# EAGLE design wemos_gpio_7x (EAGLE 7.7.0)
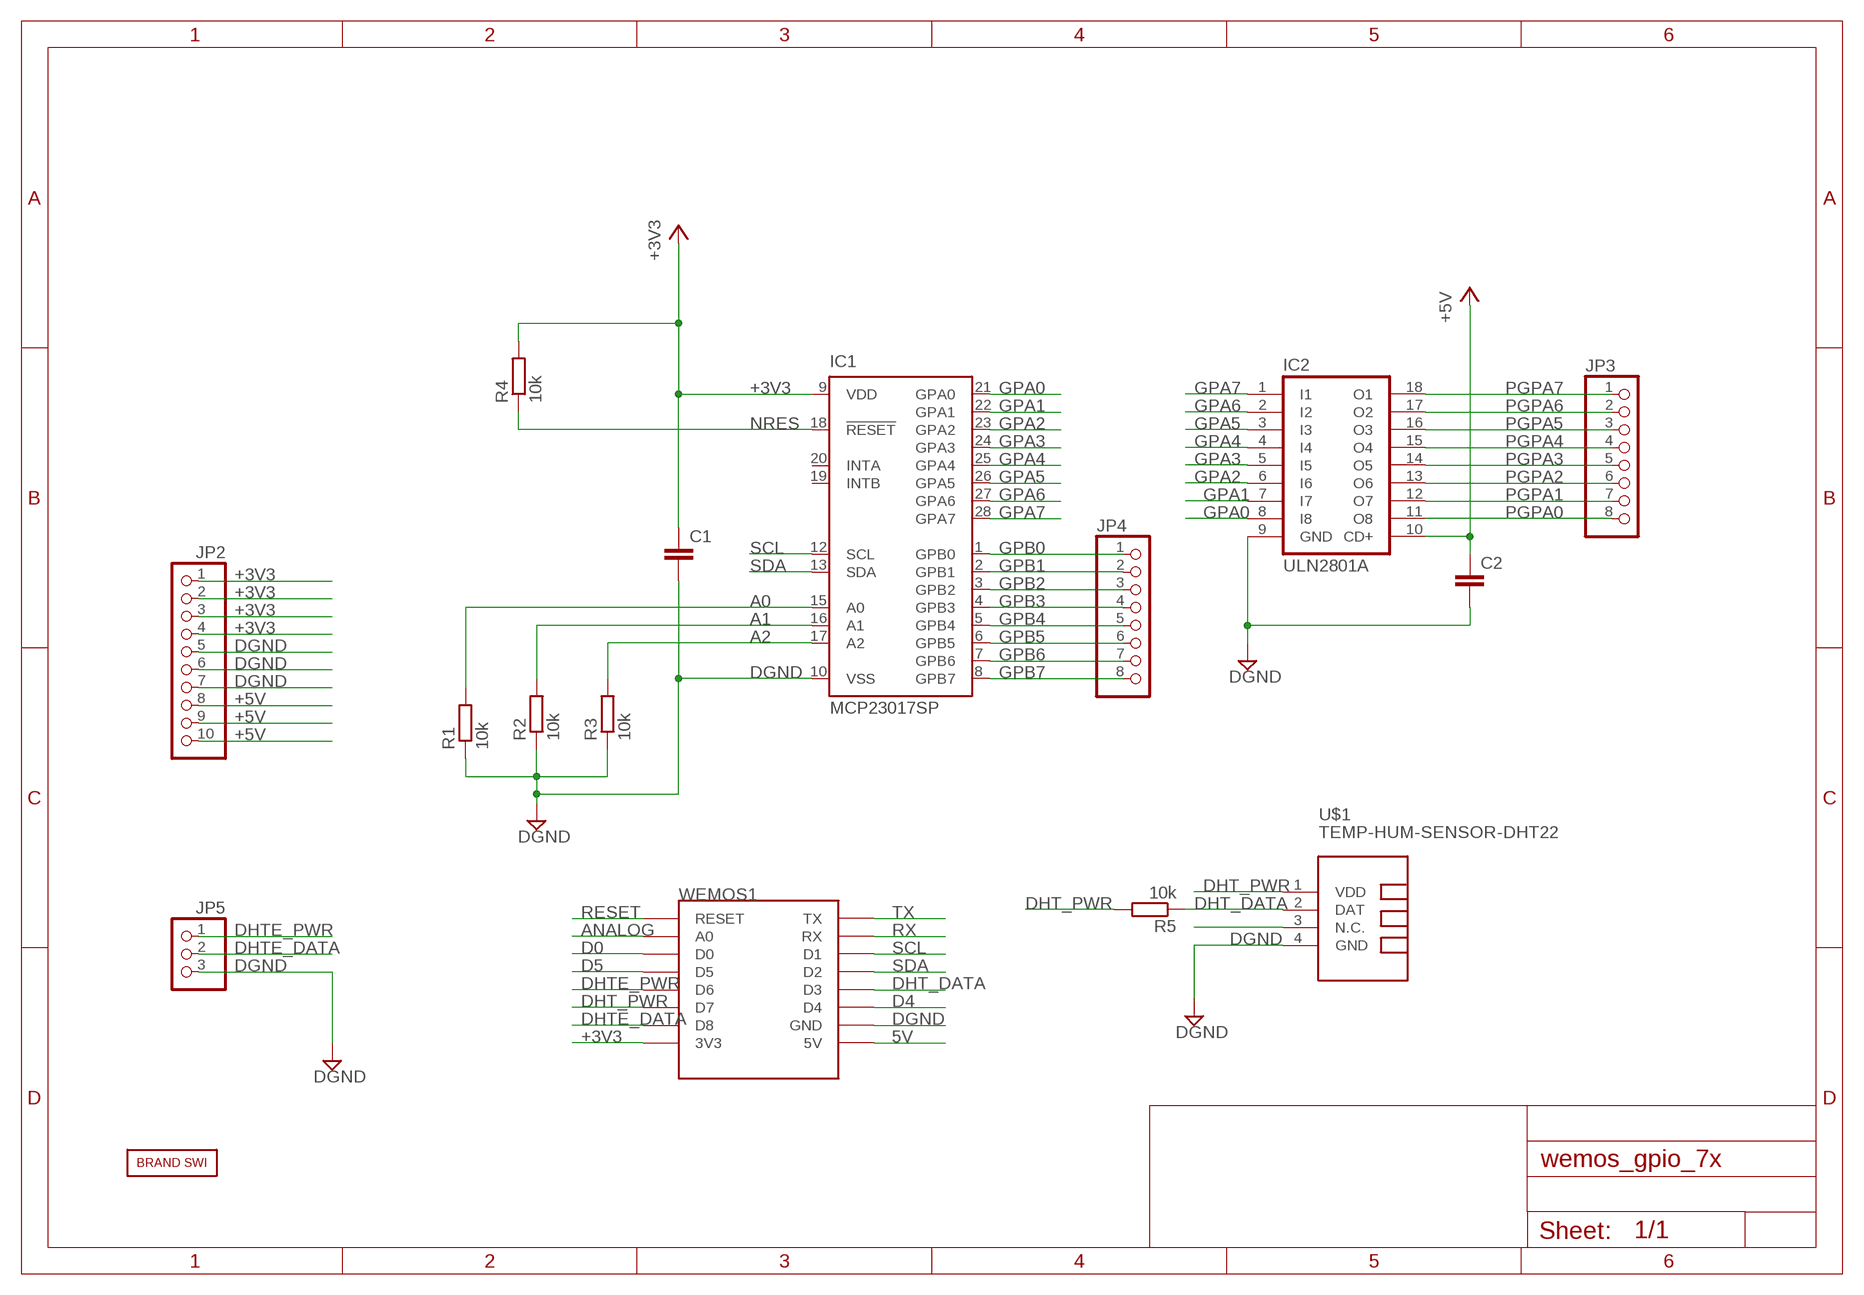
[diagram p0: schematic, sheet 1]

## Parts
C1  C-EUC1210  [C1210]
C2  C-EUC1210  [C1210]
IC1  MCP23017SP  [DIL28-3]
IC2  ULN2801A  [DIL18]
JP2  PINHD-1X10  [1X10]
JP3  PINHD-1X8  [1X08]
JP4  PINHD-1X8  [1X08]
JP5  PINHD-1X3  [1X03]
R1  10k  R-EU_M1206  [M1206]
R2  10k  R-EU_M1206  [M1206]
R3  10k  R-EU_M1206  [M1206]
R4  10k  R-EU_M1206  [M1206]
R5  10k  R-EU_M1206  [M1206]
U$1  TEMP-HUM-SENSOR-DHT22  [TEMP-HUM-SENSOR-DHT22]
U$2  BRAND_SWI5X7  [BRAND_SWI_5X7]
WEMOS1  WEMOS-D1-MINI  [WEMOS-D1-MINI]

## Nets
5V: WEMOS1.5V
+3V3: C1.1 IC1.9(VDD) JP2.1 JP2.2 JP2.3 JP2.4 R4.2 WEMOS1.3V3
+5V: C2.1 IC2.10(CD+) JP2.8 JP2.9 JP2.10
A0: IC1.15(A0) R1.2
A1: IC1.16(A1) R2.2
A2: IC1.17(A2) R3.2
ANALOG: WEMOS1.A0
D0: WEMOS1.D0
D4: WEMOS1.D4
D5: WEMOS1.D5
DGND: C1.2 C2.2 IC1.10(VSS) IC2.9(GND) JP2.5 JP2.6 JP2.7 JP5.3 R1.1 R2.1 R3.1 U$1.4(GND) WEMOS1.GND
DHT_DATA: R5.1 U$1.2(DAT) WEMOS1.D3
DHT_PWR: R5.2 U$1.1(VDD) WEMOS1.D7
DHTE_DATA: JP5.2 WEMOS1.D8
DHTE_PWR: JP5.1 WEMOS1.D6
GPA0: IC1.21(GPA0) IC2.8(I8)
GPA1: IC1.22(GPA1) IC2.7(I7)
GPA2: IC1.23(GPA2) IC2.6(I6)
GPA3: IC1.24(GPA3) IC2.5(I5)
GPA4: IC1.25(GPA4) IC2.4(I4)
GPA5: IC1.26(GPA5) IC2.3(I3)
GPA6: IC1.27(GPA6) IC2.2(I2)
GPA7: IC1.28(GPA7) IC2.1(I1)
GPB0: IC1.1(GPB0) JP4.1
GPB1: IC1.2(GPB1) JP4.2
GPB2: IC1.3(GPB2) JP4.3
GPB3: IC1.4(GPB3) JP4.4
GPB4: IC1.5(GPB4) JP4.5
GPB5: IC1.6(GPB5) JP4.6
GPB6: IC1.7(GPB6) JP4.7
GPB7: IC1.8(GPB7) JP4.8
N$3: U$1.3(N.C.)
NRES: IC1.18(!RESET) R4.1
PGPA0: IC2.11(O8) JP3.8
PGPA1: IC2.12(O7) JP3.7
PGPA2: IC2.13(O6) JP3.6
PGPA3: IC2.14(O5) JP3.5
PGPA4: IC2.15(O4) JP3.4
PGPA5: IC2.16(O3) JP3.3
PGPA6: IC2.17(O2) JP3.2
PGPA7: IC2.18(O1) JP3.1
RESET: WEMOS1.RESET
RX: WEMOS1.RX
SCL: IC1.12(SCL) WEMOS1.D1
SDA: IC1.13(SDA) WEMOS1.D2
Unconnected: IC1.19(INTB) IC1.20(INTA) WEMOS1.TX

## Library data of the parts
C1 C2 = rcl:C-EU: CAPACITOR, European symbol
IC1 = SWI_COMMONS:MCP23017: http://ww1.microchip.com/downloads/en/DeviceDoc/21952a.pdf Source: http://ww1.microchip.com/downloads/en/DeviceDoc/21952a.pdf; MF: MICROCHIP; MPN: MCP23017-E/SP; OC_FARNELL: 1332088; OC_NEWARK: 31K2959
IC2 = uln-udn:ULN2801A: DRIVER ARRAY
JP2 = pinhead:PINHD-1X10: PIN HEADER
JP3 JP4 = pinhead:PINHD-1X8: PIN HEADER
JP5 = pinhead:PINHD-1X3: PIN HEADER
R1-R5 = rcl@1:R-EU_: RESISTOR, European symbol
U$1 = SWI_COMMONS:TEMP-HUM-SENSOR-DHT22: DHT22 - digital humidity & temperature sensor Also known as: AM2302 AM2302 datasheet available here: http://akizukidenshi.com/download/ds/aosong/AM2302.pdf Click here to find device on ebay.com <http://www.ebay.com/sch/dht22+digital+sensor>
U$2 = BRAND_SWI:BRAND_SWI
WEMOS1 = SWI_COMMONS:WEMOS-D1-MINI: WeMos.cc D1 mini ESP8266 module

## Board
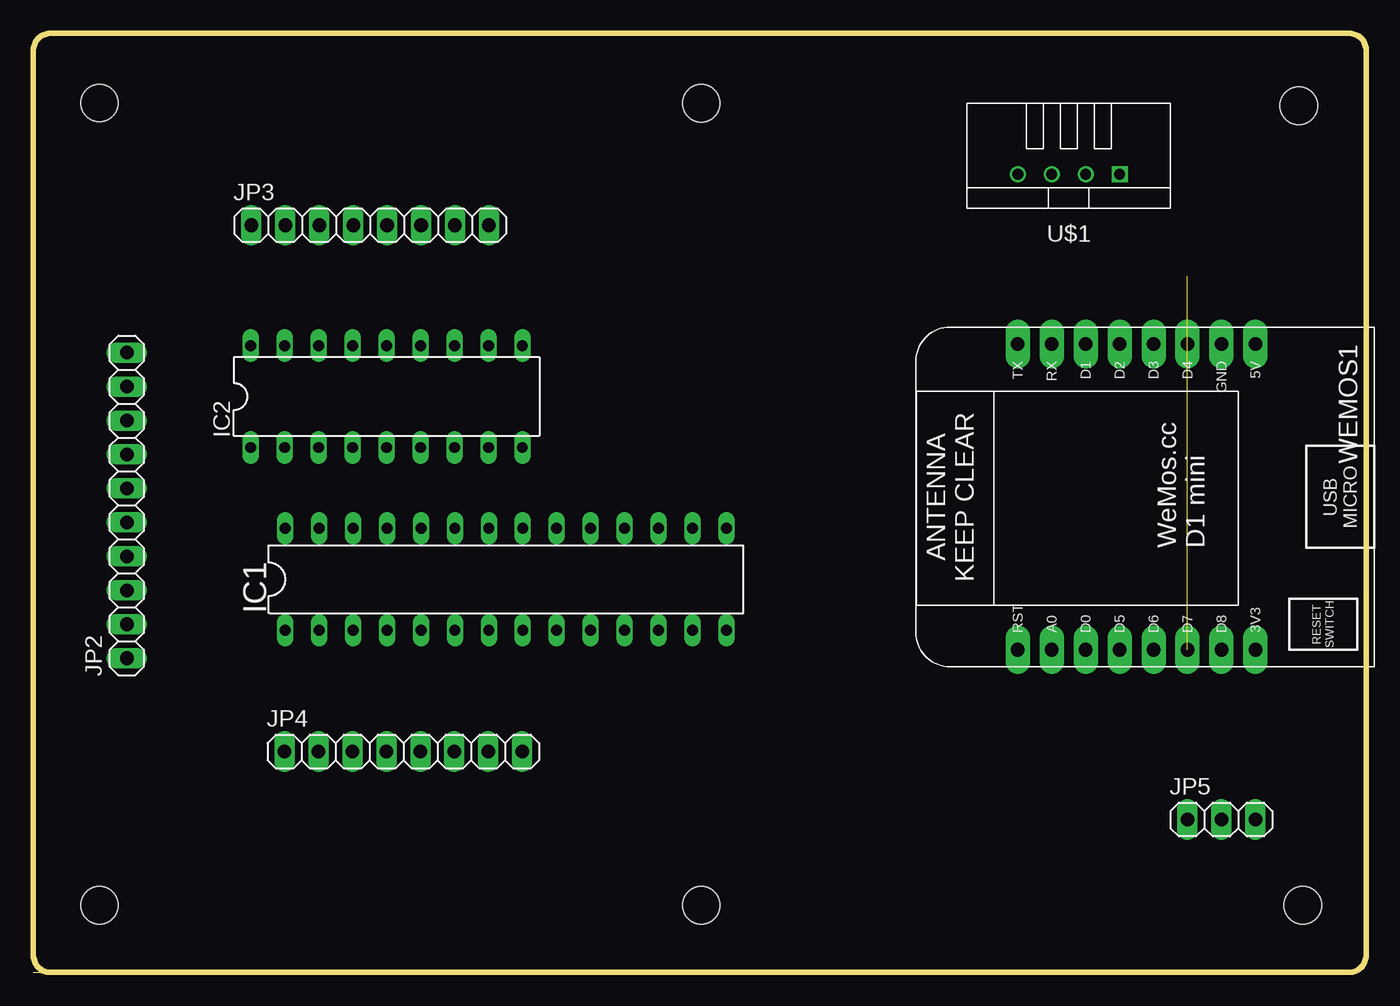
[diagram p1: board, top side]
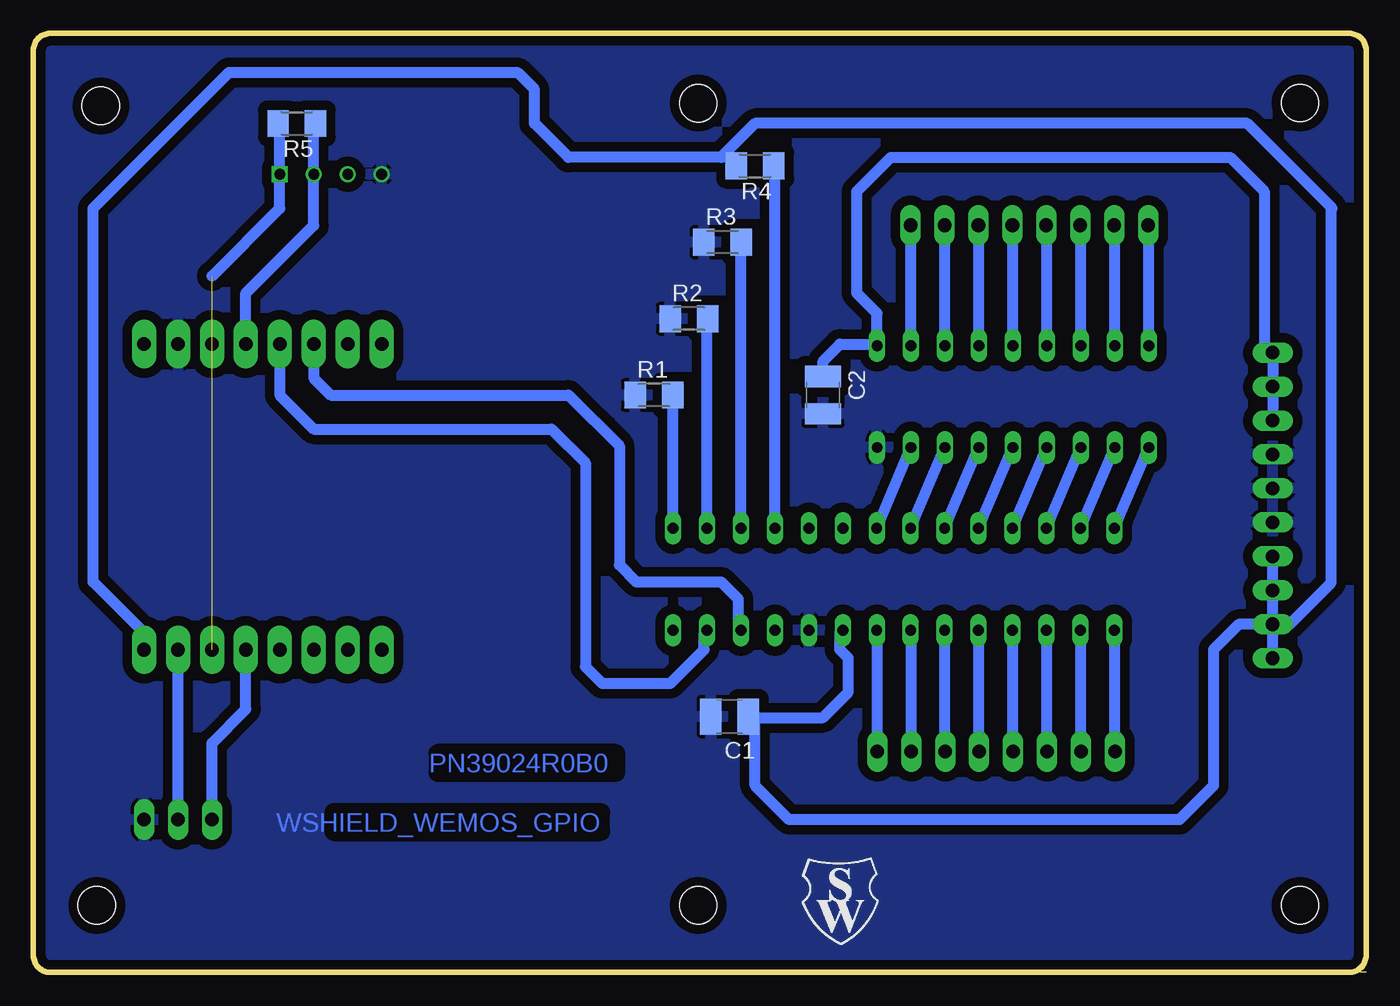
[diagram p2: board, bottom side, seen from below]

Size 99.72 x 70.23 mm. Coordinates in mm from the lower left corner, seen from the top.
Outline: 0,0 1.27,0
Outline: 1.27,0 2.03,0
Outline: 28.45,0 31.42,0
Outline: 1.27,0 98.45,0 arc90 99.72,1.27 99.72,68.96 arc90 98.45,70.23 1.27,70.23 arc90 0,68.96 0,1.27 arc90 1.27,0
Copper layers (1*16): Top 0.035mm / dielectric 1.6mm / Bottom 0.035mm
Design rules "Elecrow_2-layer_PCB_eagle_rule *": minimum track width 12mil, minimum drill 12mil, track to track 6mil, track to pad 6mil, pad to pad 6mil, via to via 8mil, smd to smd 0mil, copper to edge 20mil, drill to drill 10mil, minimum pad ring 6mil, minimum via ring 6mil, stop-mask expansion 0mil, vias tented up to drill 100mil, thermal gap 10mil
Holes 2.8 mm at 4.94,65.02 4.94,5.01 94.98,5.01 94.68,64.81 49.98,65.01 49.98,5.01

### Footprints (pad centres in the part's own frame; a part is rotated, then mirrored left to right if it is on the bottom)
C1210 = smd 1.6 x 2.7: 1 -1.4,0; 2 1.4,0
DIL28-3 = drill 0.813 long: 1 -16.51,-3.81; 2 -13.97,-3.81; 3 -11.43,-3.81; 4 -8.89,-3.81; 5 -6.35,-3.81; 6 -3.81,-3.81; 7 -1.27,-3.81; 8 1.27,-3.81; 9 3.81,-3.81; 10 6.35,-3.81; 11 8.89,-3.81; 12 11.43,-3.81; 13 13.97,-3.81; 14 16.51,-3.81; 15 16.51,3.81; 16 13.97,3.81; 17 11.43,3.81; 18 8.89,3.81; 19 6.35,3.81; 20 3.81,3.81; 21 1.27,3.81; 22 -1.27,3.81; 23 -3.81,3.81; 24 -6.35,3.81; 25 -8.89,3.81; 26 -11.43,3.81; 27 -13.97,3.81; 28 -16.51,3.81
DIL18 = drill 0.813 long: 1 -10.16,-3.81; 2 -7.62,-3.81; 3 -5.08,-3.81; 4 -2.54,-3.81; 5 0,-3.81; 6 2.54,-3.81; 7 5.08,-3.81; 8 7.62,-3.81; 9 10.16,-3.81; 10 10.16,3.81; 11 7.62,3.81; 12 5.08,3.81; 13 2.54,3.81; 14 0,3.81; 15 -2.54,3.81; 16 -5.08,3.81; 17 -7.62,3.81; 18 -10.16,3.81
1X10 = drill 1.016 long: 1 -11.43,0; 2 -8.89,0; 3 -6.35,0; 4 -3.81,0; 5 -1.27,0; 6 1.27,0; 7 3.81,0; 8 6.35,0; 9 8.89,0; 10 11.43,0
1X08 = drill 1.016 long: 1 -8.89,0; 2 -6.35,0; 3 -3.81,0; 4 -1.27,0; 5 1.27,0; 6 3.81,0; 7 6.35,0; 8 8.89,0
1X03 = drill 1.016 long: 1 -2.54,0; 2 0,0; 3 2.54,0
M1206 = smd 1.6 x 2: 1 -1.4,0; 2 1.4,0
TEMP-HUM-SENSOR-DHT22 = drill 0.8 square: 1 -3.81,0 | drill 0.8: 2 -1.27,0; 3 1.27,0; 4 3.81,0
WEMOS-D1-MINI = drill 1.016 pad 1.829 long: 3V3 -10.16,-10.16; 5V 12.7,-10.16; A0 -10.16,5.08; D0 -10.16,2.54; D1 12.7,2.54; D2 12.7,0; D3 12.7,-2.54; D4 12.7,-5.08; D5 -10.16,0; D6 -10.16,-2.54; D7 -10.16,-5.08; D8 -10.16,-7.62; GND 12.7,-7.62; RESET -10.16,7.62; RX 12.7,5.08; TX 12.7,7.62

### Placement (x,y rotation side)
C1  47.62,19.13 180 bottom
C2  40.64,43.18 270 bottom
IC1  35.35,29.4 0 top
IC2  26.43,43.07 0 top
JP2  6.99,34.92 90 top
JP3  25.2,55.88 0 top
JP4  27.69,16.51 0 top
JP5  88.9,11.43 0 top
R1  53.29,43.18 0 bottom
R2  50.67,48.9 0 bottom
R3  48.16,54.61 0 bottom
R4  45.72,60.33 180 bottom
R5  80.01,63.5 180 bottom
U$1  77.47,59.69 180 top
U$2  42.42,1.91 0 bottom
WEMOS1  81.28,34.29 90 top

### Tracks (layer width: path | path; a pad name or v marks a point on that pad's centre or on a via)
+3V3
  Bottom 0.813: 45.72,19.05 46.15,19.05 C1.1 | WEMOS1.3V3 91.44,25.4 95.25,29.21 95.25,57.15 85.09,67.31 63.5,67.31 62.23,66.04 62.23,63.5 59.69,60.96 48.26,60.96 | 48.26,60.96 47.76,60.96 R4.2 | JP2.2 5.71,26.04 2.61,29.14 2.61,57.08 2.54,57.15 8.89,63.5 45.72,63.5 48.26,60.96 | JP2.2 9.53,26.04 11.43,24.13 11.43,13.97 13.97,11.43 43.18,11.43 45.72,13.97 45.72,19.05 | JP2.1 JP2.2 | JP2.2 JP2.3 JP2.4 | 45.72,19.05 40.64,19.05 38.73,20.95 38.73,23.5 39.37,24.13 39.37,25.38 IC1.9
+5V
  Bottom 0.813: C2.1 40.64,45.72 39.37,46.99 36.7,46.99 IC2.10 36.59,49.28 38.1,50.8 38.1,58.42 35.56,60.96 10.16,60.96 7.62,58.42 7.62,46.99 JP2.10 JP2.9 JP2.8
A0
  Bottom 0.813: IC1.15 51.86,43.15 R1.2
A1
  Bottom 0.813: IC1.16 49.32,48.85 R2.2
A2
  Bottom 0.813: IC1.17 46.78,54.59 R3.2
DGND
  pour Bottom (isolate 0.711): 2.54,0 97.79,0 99.06,1.27 99.06,68.58 97.79,69.85 1.27,69.85 0,68.58 0,1.27 1.27,0
DHT_DATA
  Bottom 0.813: R5.1 78.74,63.37 U$1.2 78.74,55.88 83.82,50.8 WEMOS1.D3
DHT_PWR  (1 unrouted)
  Bottom 0.813: R5.2 81.28,63.37 U$1.1 81.28,57.15 86.36,52.07
DHTE_DATA
  Bottom 0.813: JP5.2 WEMOS1.D8
DHTE_PWR
  Bottom 0.813: JP5.1 86.36,17.14 83.82,19.68 WEMOS1.D6
GPA0
  Bottom 0.813: IC1.21 IC2.8
GPA1
  Bottom 0.813: IC1.22 IC2.7
GPA2
  Bottom 0.813: IC1.23 IC2.6
GPA3
  Bottom 0.813: IC1.24 IC2.5
GPA4
  Bottom 0.813: IC1.25 IC2.4
GPA5
  Bottom 0.813: IC1.26 IC2.3
GPA6
  Bottom 0.813: IC1.27 IC2.2
GPA7
  Bottom 0.813: IC1.28 IC2.1
GPB0
  Bottom 0.813: IC1.1 18.84,16.55 JP4.1
GPB1
  Bottom 0.813: JP4.2 21.34,25.55 IC1.2
GPB2
  Bottom 0.813: IC1.3 23.92,16.55 JP4.3
GPB3
  Bottom 0.813: IC1.4 26.46,16.55 JP4.4
GPB4
  Bottom 0.813: JP4.5 28.96,25.55 IC1.5
GPB5
  Bottom 0.813: IC1.6 31.54,16.55 JP4.6
GPB6
  Bottom 0.813: JP4.7 34.04,25.55 IC1.7
GPB7
  Bottom 0.813: IC1.8 36.62,16.55 JP4.8
NRES
  Bottom 0.813: IC1.18 44.24,60.24 R4.1
PGPA0
  Bottom 0.813: IC2.11 34.05,55.84 JP3.8
PGPA1
  Bottom 0.813: JP3.7 31.55,46.92 IC2.12
PGPA2
  Bottom 0.813: IC2.13 28.96,55.84 JP3.6
PGPA3
  Bottom 0.813: JP3.5 26.47,46.92 IC2.14
PGPA4
  Bottom 0.813: IC2.15 23.89,55.84 JP3.4
PGPA5
  Bottom 0.813: JP3.3 21.39,46.92 IC2.16
PGPA6
  Bottom 0.813: IC2.17 18.8,55.84 JP3.2
PGPA7
  Bottom 0.813: IC2.18 16.27,55.84 JP3.1
SCL
  Bottom 0.813: WEMOS1.D1 78.74,44.45 77.47,43.18 59.69,43.18 55.88,39.37 55.88,30.48 54.61,29.21 48.26,29.21 46.99,27.94 46.99,25.8 IC1.12
SDA
  Bottom 0.813: WEMOS1.D2 81.28,43.18 78.74,40.64 60.96,40.64 58.42,38.1 58.42,22.86 57.15,21.59 52.07,21.59 49.53,24.13 49.53,25.38 IC1.13

### Text on the board
Bottom: PN39024R0B0 | WSHIELD_WEMOS_GPIO